# Altium schematic sheet FLYBACK_SWITCHING_POWER_SUPPLY_V1_0.SchDoc
size A4; SheetNumber: 1; SheetTotal: 1
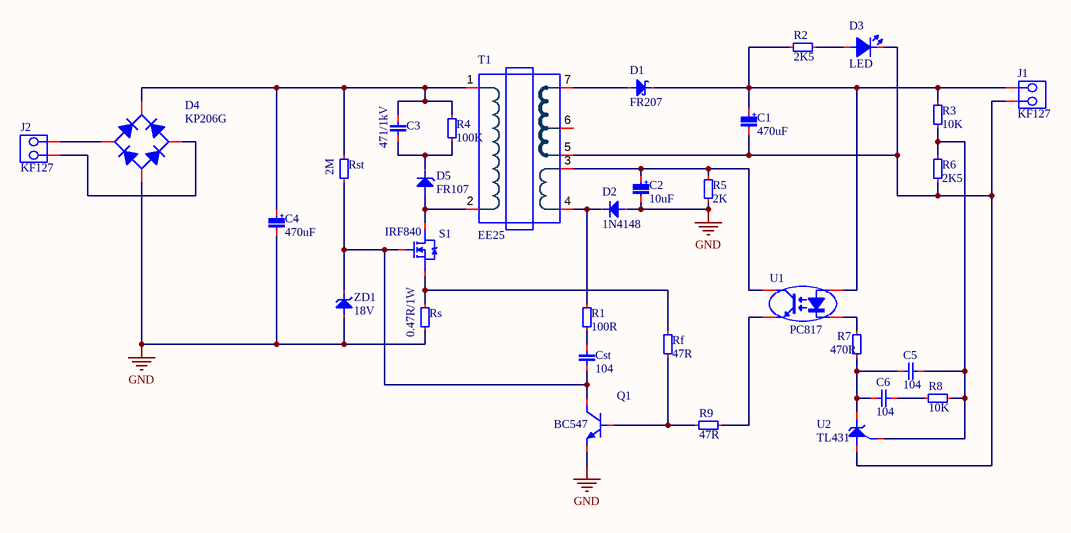
[diagram p0: FLYBACK_SWITCHING_POWER_SUPPLY_V1_0.SchDoc]

## Parts
C1  470uF  [CAP_RAD_D10x12.5]
C2  10uF  [CAP_RAD_D05x11]
C3  471/1kV  [CAP_Ceramic_5MM]
C4  470uF  [CAP_RAD_D10x12.5]
C5  104  [CAP_Ceramic_2.5MM]
C6  104  [CAP_Ceramic_2.5MM]
Cst  104  [CAP_Ceramic_2.5MM]
D1  FR207  [DO-204AC-BK]
D2  1N4148  [DO-204AH-RD]
D3  LED  [LED_5MM]
D4  KP206G  [DIODE_2A]
D5  FR107  [DO-204AL-BK]
J1  KF127  [DG127-5.0-02P-14-00AH]
J2  KF127  [DG127-5.0-02P-14-00AH]
Q1  BC547  [TO-92]
R1  100R  [RES-0.25W-H]
R2  2K5  [RES-0.25W-H]
R3  10K  [RES-0.25W-H]
R4  100K  [RES-0.5W-H]
R5  2K  [RES-0.25W-H]
R6  2K5  [RES-0.25W-H]
R7  470R  [RES-0.25W-H]
R8  10K  [RES-0.25W-H]
R9  47R  [RES-0.25W-V]
Rf  47R  [RES-0.25W-H]
Rs  0.47R/1W  [RES-1W-H]
Rst  2M  [RES-0.25W-H]
S1  IRF840  [TO-220-HEAT-SINK-1]
T1  EE25  [TRANSFORMER-FLUOLAMP-8W]
U1  PC817  [PC817-DIP]
U2  TL431  [TO-92]
ZD1  18V  [DO-204AL-RD]

## Nets
GND: C2.2 C4.2 D2.1 D4.1 Q1.3(E) R5.1 Rs.1 ZD1.1
NetC1_1: C1.1 D1.2 J1.2 R2.1 R3.2 U1.1(A)
NetC1_2: C1.2 D3.2(K) J1.1 R6.1 T1.5 U2.2
NetC2_1: C2.1 R5.2 T1.3 U1.4(C)
NetC3_1: C3.1 D5.2 R4.1
NetC3_2: C3.2 C4.1 D4.4 R4.2 Rst.2 T1.1
NetC5_1: C5.1 R3.1 R6.2 R8.1 U2.1
NetC5_2: C5.2 C6.2 R7.1 U2.3
NetC6_1: C6.1 R8.2
NetCst_1: Cst.1 Q1.1(C) Rst.1 S1.1(G) ZD1.2
NetCst_2: Cst.2 R1.1
NetD1_1: D1.1 T1.7
NetD2_2: D2.2 R1.2 T1.4
NetD3_1: D3.1(A) R2.2
NetD4_2: D4.2 J2.1
NetD4_3: D4.3 J2.2
NetD5_1: D5.1 S1.2(D) T1.2
NetQ1_2: Q1.2(B) R9.2 Rf.1
NetR7_2: R7.2 U1.2(K)
NetR9_1: R9.1 U1.3(E)
NetRf_2: Rf.2 Rs.2 S1.3(S)

Not connected (* = marked no-connect by the designer): T1 6

## Notes on the sheet
- (in symbol Capacitor(Radian)) +

## Library data of the parts
C1 C2 C4 = Capacitor(Radian)
C3 C5 C6 Cst = Capacitors(Disc)
D1 = Diode-FR207
D2 = Diode-1N4148
D3 = LED 5MM
D4 = Diode_KP206G
D5 = Diode-FR107: 1A 1000V
J1 J2 = DG127-5.0-02P-14-00AH
Q1 = Transistor-BC547: VCEO: 45 Vdc / VCBO: 50 Vdc / VEBO: 6.0 Vdc
R1-R9 Rf Rs Rst = Resistors THD
S1 = Mosfet-IRF840
T1 = TRANS-FLUOLAMP-V0
U1 = Opto-PC817
U2 = Ic-TL431
ZD1 = Diode-Zener